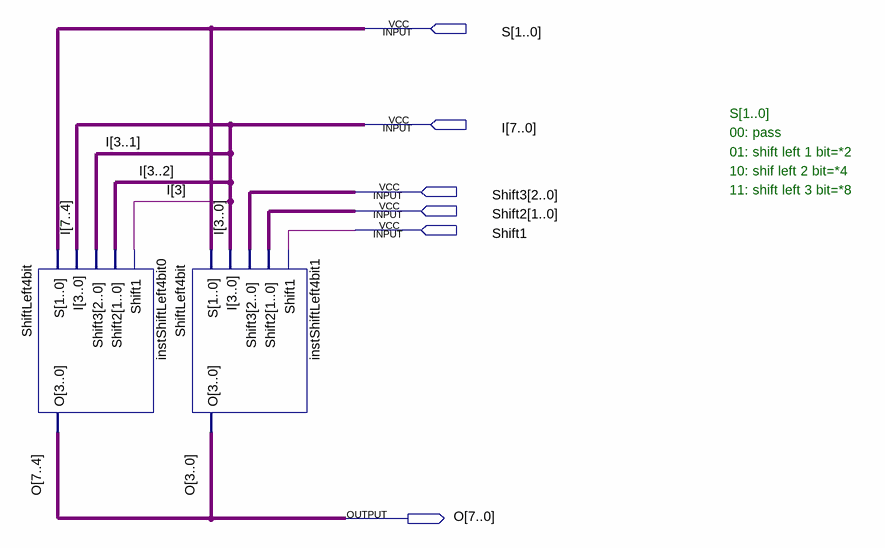
[diagram p0: schematic sheet]
// Quartus schematic ShiftLeft8bit.bdf as structural Verilog: 2 symbols, 6 pins
module ShiftLeft8bit (
  input  [1:0] S,
  input  [7:0] I,
  input  [2:0] Shift3,
  input  [1:0] Shift2,
  input  Shift1,
  output [7:0] O
);

  ShiftLeft4bit instShiftLeft4bit0 (.S(S), .I(I[7:4]), .Shift3(I[3:1]), .Shift2(I[3:2]), .Shift1(I[3]), .O(O[7:4]));
  ShiftLeft4bit instShiftLeft4bit1 (.S(S), .I(I[3:0]), .Shift3(Shift3), .Shift2(Shift2), .Shift1(Shift1), .O(O[3:0]));

  // Notes on the sheet:
  //   S[1..0]
  //   00: pass
  //   01: shift left 1 bit=*2
  //   10: shif left 2 bit=*4
  //   11: shift left 3 bit=*8
endmodule
